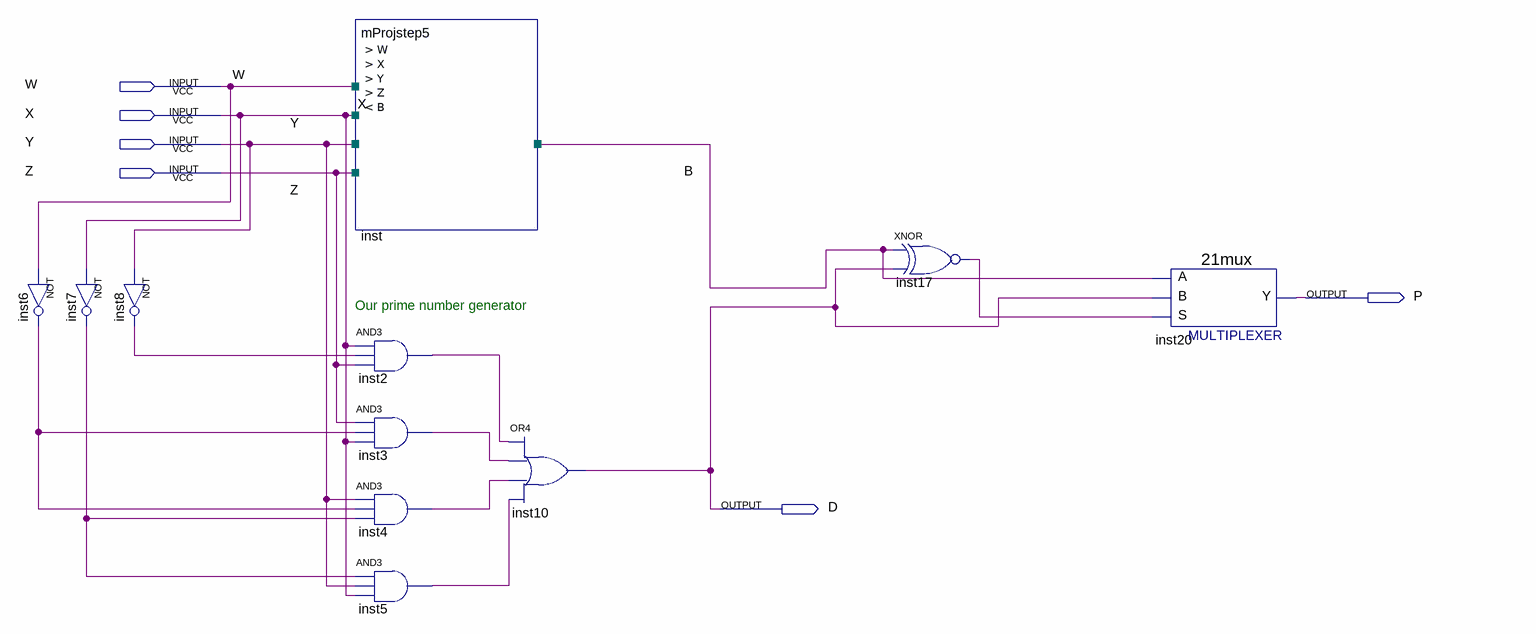
[diagram p0: schematic sheet]
// Quartus schematic mProjstep8.bdf as structural Verilog: 11 symbols, 6 pins
module mProjstep8 (
  input  W,
  input  X,
  input  Y,
  input  Z,
  output P,
  output D
);

  wire B, inst2_out, inst3_out, inst4_out, inst5_out, inst6_out, inst7_out, inst8_out, inst17_out;

  not inst6 (inst6_out, W);
  not inst7 (inst7_out, X);
  not inst8 (inst8_out, Y);
  mProjstep5 inst (.W(W), .X(X), .Y(Y), .Z(Z), .B(B));
  and inst2 (inst2_out, X, inst8_out, Z);
  and inst3 (inst3_out, Z, inst6_out, X);
  and inst4 (inst4_out, Y, inst6_out, inst7_out);
  and inst5 (inst5_out, inst7_out, Y, X);
  or inst10 (D, inst2_out, inst3_out, inst4_out, inst5_out);
  xnor inst17 (inst17_out, B, D);
  \21mux  inst20 (.S(inst17_out), .B(D), .A(B), .Y(P));

  // Notes on the sheet:
  //   Our prime number generator
endmodule
